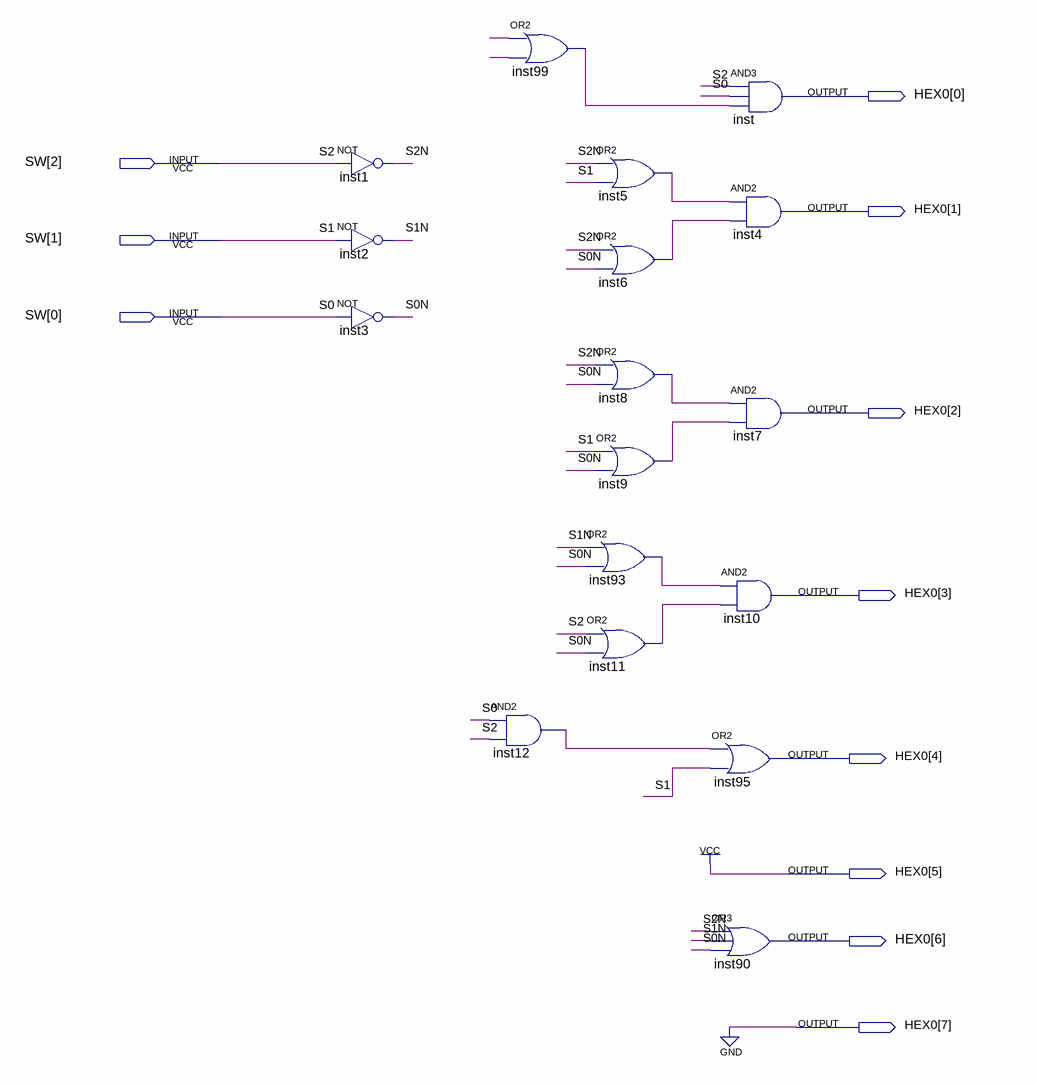
[diagram p0: schematic sheet]
// Quartus schematic lab2_pos.bdf as structural Verilog: 17 symbols, 11 pins
module lab2_pos (
  input  [2:0] SW,
  output [7:0] HEX0
);

  wire inst5_out, inst6_out, inst8_out, inst9_out, inst11_out, inst12_out, inst93_out, inst99_out, S0N, S1N,
       S2N, undriven, undriven_2;

  not inst1 (S2N, SW[2]);
  not inst2 (S1N, SW[1]);
  not inst3 (S0N, SW[0]);
  or inst99 (inst99_out, undriven, undriven_2);
  and inst12 (inst12_out, SW[0], SW[2]);
  or inst5 (inst5_out, S2N, SW[1]);
  or inst6 (inst6_out, S2N, S0N);
  or inst8 (inst8_out, S2N, S0N);
  or inst9 (inst9_out, SW[1], S0N);
  or inst93 (inst93_out, S1N, S0N);
  or inst11 (inst11_out, SW[2], S0N);
  and inst (HEX0[0], SW[2], SW[0], inst99_out);
  and inst4 (HEX0[1], inst5_out, inst6_out);
  and inst7 (HEX0[2], inst8_out, inst9_out);
  and inst10 (HEX0[3], inst93_out, inst11_out);
  or inst95 (HEX0[4], inst12_out, SW[1]);
  or inst90 (HEX0[6], S2N, S1N, S0N);

  assign {HEX0[7], HEX0[5]} = 2'b01;

  // Other names for the same wires on the sheet: S0 = SW[0]; S1 = SW[1]; S2 = SW[2]
endmodule
